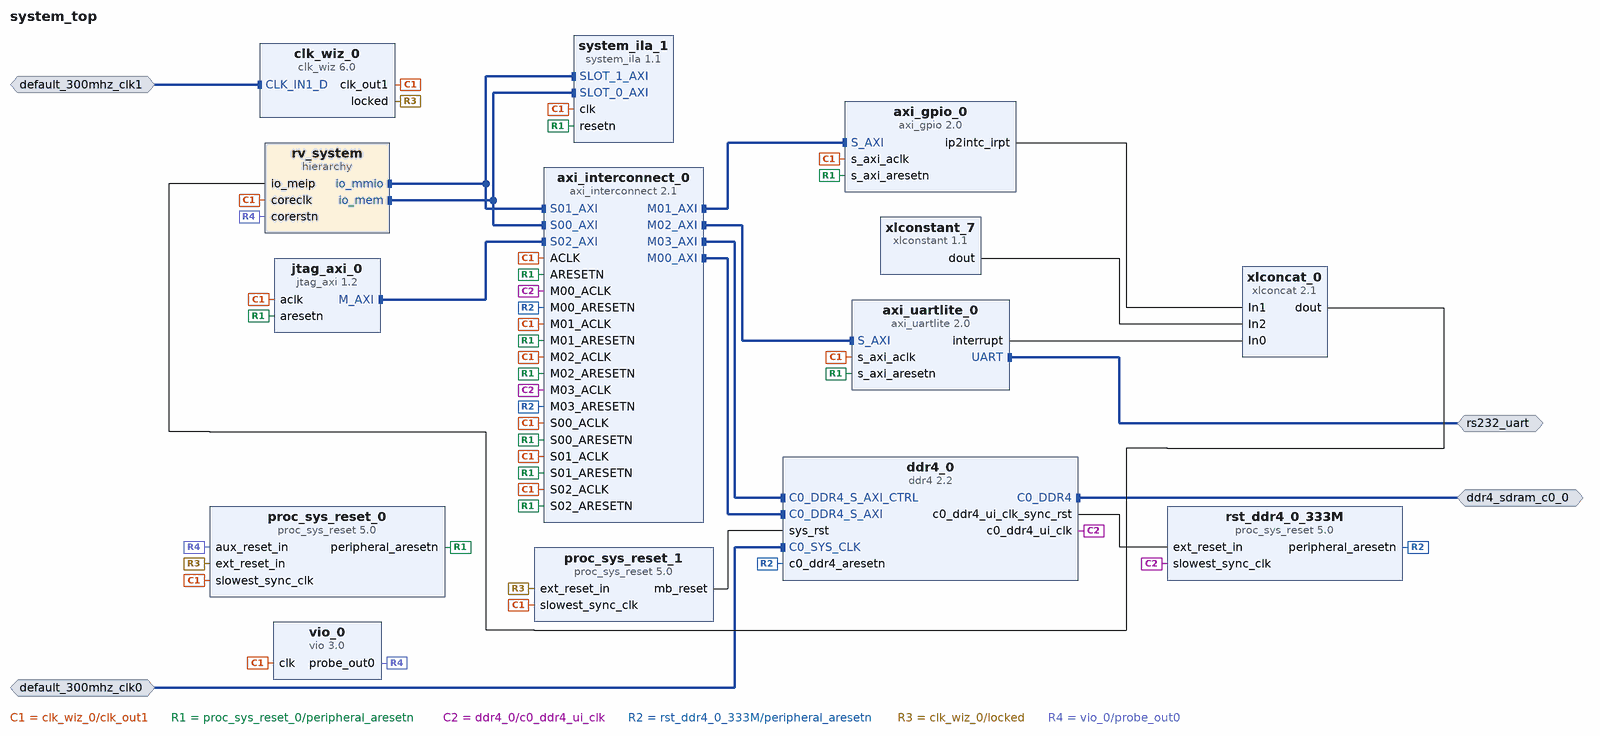
[diagram p0: block diagram of the top level]
# Vivado block design system_top, xcu250-figd2104-2L-e, Vivado 2020.2
create_bd_design system_top

create_bd_intf_port -mode Master -vlnv xilinx.com:interface:uart_rtl:1.0 rs232_uart
create_bd_intf_port -mode Slave -vlnv xilinx.com:interface:diff_clock_rtl:1.0 default_300mhz_clk0
set_property -dict {CONFIG.FREQ_HZ 300000000} [get_bd_intf_ports default_300mhz_clk0]
create_bd_intf_port -mode Master -vlnv xilinx.com:interface:ddr4_rtl:1.0 ddr4_sdram_c0_0
create_bd_intf_port -mode Slave -vlnv xilinx.com:interface:diff_clock_rtl:1.0 default_300mhz_clk1
set_property -dict {CONFIG.FREQ_HZ 300000000} [get_bd_intf_ports default_300mhz_clk1]

create_bd_cell -type hier rv_system
create_bd_cell -type ip -vlnv xilinx.com:ip:clk_wiz:6.0 clk_wiz_0
set_property -dict [list \
  CONFIG.CLK_IN1_BOARD_INTERFACE default_300mhz_clk1 \
  CONFIG.PRIM_SOURCE Differential_clock_capable_pin \
  CONFIG.RESET_BOARD_INTERFACE Custom \
  CONFIG.USE_BOARD_FLOW true \
  CONFIG.USE_RESET false \
] [get_bd_cells clk_wiz_0]
create_bd_cell -type ip -vlnv xilinx.com:ip:proc_sys_reset:5.0 proc_sys_reset_0
create_bd_cell -type ip -vlnv xilinx.com:ip:ddr4:2.2 ddr4_0
set_property -dict [list \
  CONFIG.C0_CLOCK_BOARD_INTERFACE default_300mhz_clk0 \
  CONFIG.C0_DDR4_BOARD_INTERFACE ddr4_sdram_c0 \
] [get_bd_cells ddr4_0]
create_bd_cell -type ip -vlnv xilinx.com:ip:axi_gpio:2.0 axi_gpio_0
set_property -dict [list \
  CONFIG.C_ALL_INPUTS 0 \
  CONFIG.C_ALL_OUTPUTS 1 \
  CONFIG.C_GPIO_WIDTH 1 \
  CONFIG.C_INTERRUPT_PRESENT 1 \
] [get_bd_cells axi_gpio_0]
create_bd_cell -type ip -vlnv xilinx.com:ip:axi_uartlite:2.0 axi_uartlite_0
set_property -dict [list \
  CONFIG.C_BAUDRATE 115200 \
  CONFIG.UARTLITE_BOARD_INTERFACE rs232_uart \
  CONFIG.USE_BOARD_FLOW true \
] [get_bd_cells axi_uartlite_0]
create_bd_cell -type ip -vlnv xilinx.com:ip:axi_interconnect:2.1 axi_interconnect_0
set_property -dict {CONFIG.NUM_MI 4 CONFIG.NUM_SI 3} [get_bd_cells axi_interconnect_0]
create_bd_cell -type ip -vlnv xilinx.com:ip:proc_sys_reset:5.0 rst_ddr4_0_333M
create_bd_cell -type ip -vlnv xilinx.com:ip:jtag_axi:1.2 jtag_axi_0
create_bd_cell -type ip -vlnv xilinx.com:ip:xlconcat:2.1 xlconcat_0
set_property -dict {CONFIG.NUM_PORTS 3 CONFIG.dout_width 3} [get_bd_cells xlconcat_0]
create_bd_cell -type ip -vlnv xilinx.com:ip:vio:3.0 vio_0
set_property -dict {CONFIG.C_NUM_PROBE_IN 0} [get_bd_cells vio_0]
create_bd_cell -type ip -vlnv xilinx.com:ip:proc_sys_reset:5.0 proc_sys_reset_1
create_bd_cell -type ip -vlnv xilinx.com:ip:xlconstant:1.1 xlconstant_7
create_bd_cell -type ip -vlnv xilinx.com:ip:system_ila:1.1 system_ila_1
set_property -dict [list \
  CONFIG.C_MON_TYPE INTERFACE \
  CONFIG.C_NUM_MONITOR_SLOTS 2 \
  CONFIG.C_NUM_OF_PROBES 9 \
  CONFIG.C_PROBE0_WIDTH 1 \
  CONFIG.C_PROBE5_WIDTH 1 \
  CONFIG.C_PROBE6_WIDTH 1 \
  CONFIG.C_PROBE7_WIDTH 1 \
  CONFIG.C_PROBE_WIDTH_PROPAGATION MANUAL \
] [get_bd_cells system_ila_1]

# ---- hierarchy /rv_system ----
current_bd_instance /rv_system
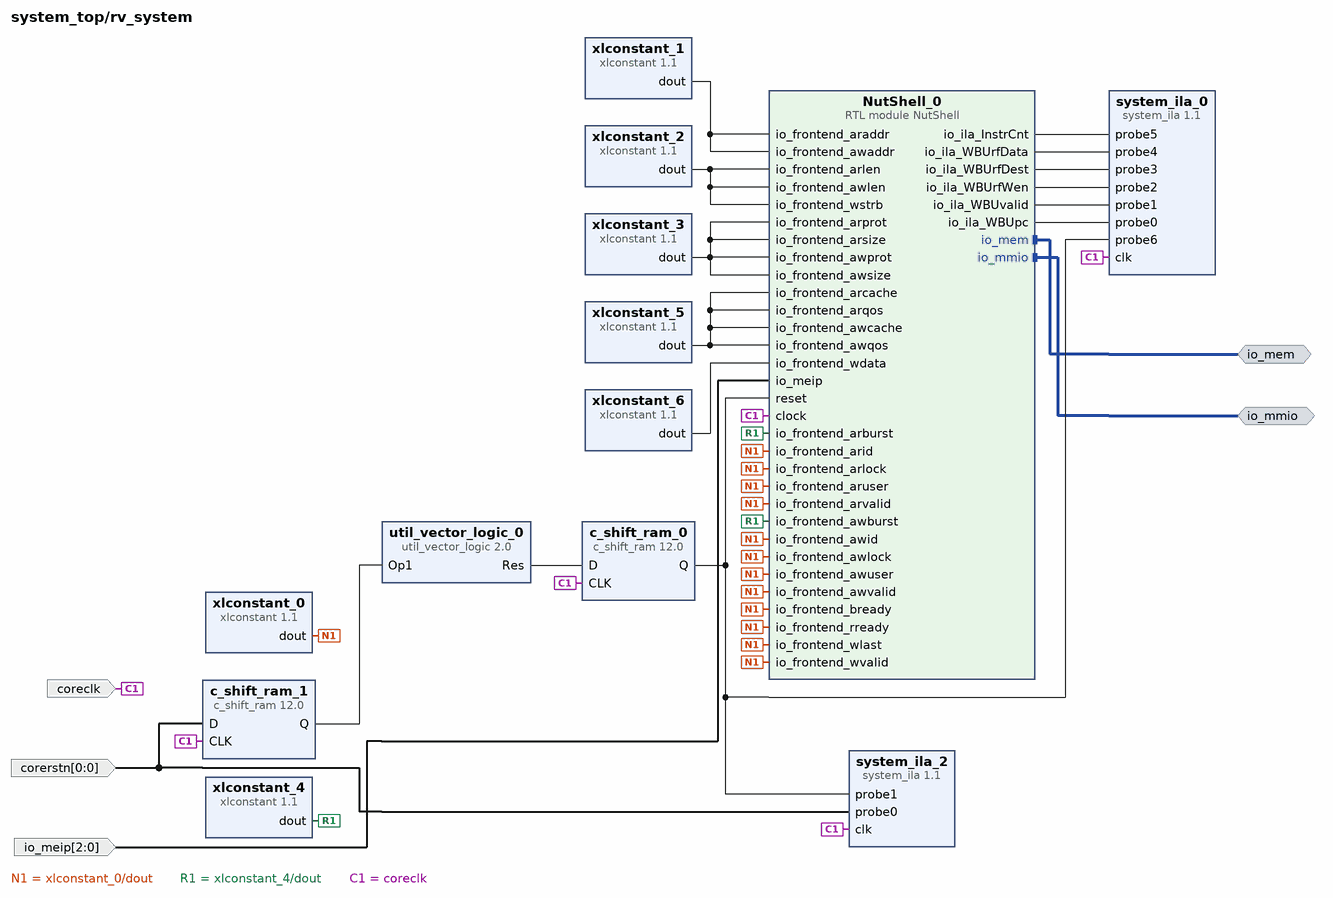
[diagram p1: block diagram inside /rv_system]
create_bd_intf_pin -mode Master -vlnv xilinx.com:interface:aximm_rtl:1.0 io_mem
create_bd_intf_pin -mode Master -vlnv xilinx.com:interface:aximm_rtl:1.0 io_mmio
create_bd_pin -dir I -type clk coreclk
create_bd_pin -dir I -from 0 -to 0 -type data corerstn
create_bd_pin -dir I -from 2 -to 0 io_meip

create_bd_cell -type ip -vlnv xilinx.com:ip:c_shift_ram:12.0 c_shift_ram_0
set_property -dict {CONFIG.AsyncInitVal 0 CONFIG.DefaultData 0 CONFIG.Depth 1 CONFIG.Width 1} [get_bd_cells c_shift_ram_0]
create_bd_cell -type ip -vlnv xilinx.com:ip:xlconstant:1.1 xlconstant_0
set_property -dict {CONFIG.CONST_VAL 0} [get_bd_cells xlconstant_0]
create_bd_cell -type ip -vlnv xilinx.com:ip:xlconstant:1.1 xlconstant_1
set_property -dict {CONFIG.CONST_VAL 0 CONFIG.CONST_WIDTH 32} [get_bd_cells xlconstant_1]
create_bd_cell -type ip -vlnv xilinx.com:ip:xlconstant:1.1 xlconstant_2
set_property -dict {CONFIG.CONST_VAL 0 CONFIG.CONST_WIDTH 8} [get_bd_cells xlconstant_2]
create_bd_cell -type ip -vlnv xilinx.com:ip:xlconstant:1.1 xlconstant_3
set_property -dict {CONFIG.CONST_VAL 0 CONFIG.CONST_WIDTH 3} [get_bd_cells xlconstant_3]
create_bd_cell -type ip -vlnv xilinx.com:ip:xlconstant:1.1 xlconstant_4
set_property -dict {CONFIG.CONST_VAL 0 CONFIG.CONST_WIDTH 2} [get_bd_cells xlconstant_4]
create_bd_cell -type ip -vlnv xilinx.com:ip:xlconstant:1.1 xlconstant_5
set_property -dict {CONFIG.CONST_VAL 0 CONFIG.CONST_WIDTH 4} [get_bd_cells xlconstant_5]
create_bd_cell -type ip -vlnv xilinx.com:ip:xlconstant:1.1 xlconstant_6
set_property -dict {CONFIG.CONST_VAL 0 CONFIG.CONST_WIDTH 64} [get_bd_cells xlconstant_6]
create_bd_cell -type ip -vlnv xilinx.com:ip:c_shift_ram:12.0 c_shift_ram_1
set_property -dict {CONFIG.AsyncInitVal 0 CONFIG.DefaultData 0 CONFIG.Depth 1 CONFIG.Width 1} [get_bd_cells c_shift_ram_1]
create_bd_cell -type ip -vlnv xilinx.com:ip:system_ila:1.1 system_ila_0
set_property -dict {CONFIG.C_MON_TYPE NATIVE CONFIG.C_NUM_MONITOR_SLOTS 1 CONFIG.C_NUM_OF_PROBES 7} [get_bd_cells system_ila_0]
create_bd_cell -type ip -vlnv xilinx.com:ip:system_ila:1.1 system_ila_2
set_property -dict {CONFIG.C_MON_TYPE NATIVE CONFIG.C_NUM_OF_PROBES 2} [get_bd_cells system_ila_2]
create_bd_cell -type module -reference NutShell NutShell_0
create_bd_cell -type ip -vlnv xilinx.com:ip:util_vector_logic:2.0 util_vector_logic_0
set_property -dict {CONFIG.C_OPERATION not CONFIG.C_SIZE 1} [get_bd_cells util_vector_logic_0]

# ---- connections ----

current_bd_instance /rv_system
connect_bd_intf_net [get_bd_intf_pins io_mem] [get_bd_intf_pins NutShell_0/io_mem]
connect_bd_intf_net [get_bd_intf_pins io_mmio] [get_bd_intf_pins NutShell_0/io_mmio]
connect_bd_net [get_bd_pins xlconstant_0/dout] \
  [get_bd_pins NutShell_0/io_frontend_awvalid] [get_bd_pins NutShell_0/io_frontend_awid] \
  [get_bd_pins NutShell_0/io_frontend_awuser] [get_bd_pins NutShell_0/io_frontend_awlock] \
  [get_bd_pins NutShell_0/io_frontend_wvalid] [get_bd_pins NutShell_0/io_frontend_wlast] \
  [get_bd_pins NutShell_0/io_frontend_bready] [get_bd_pins NutShell_0/io_frontend_arvalid] \
  [get_bd_pins NutShell_0/io_frontend_arid] [get_bd_pins NutShell_0/io_frontend_aruser] \
  [get_bd_pins NutShell_0/io_frontend_arlock] [get_bd_pins NutShell_0/io_frontend_rready]
connect_bd_net [get_bd_pins xlconstant_1/dout] [get_bd_pins NutShell_0/io_frontend_awaddr] [get_bd_pins NutShell_0/io_frontend_araddr]
connect_bd_net [get_bd_pins xlconstant_2/dout] \
  [get_bd_pins NutShell_0/io_frontend_awlen] [get_bd_pins NutShell_0/io_frontend_wstrb] \
  [get_bd_pins NutShell_0/io_frontend_arlen]
connect_bd_net [get_bd_pins xlconstant_3/dout] \
  [get_bd_pins NutShell_0/io_frontend_awprot] [get_bd_pins NutShell_0/io_frontend_awsize] \
  [get_bd_pins NutShell_0/io_frontend_arprot] [get_bd_pins NutShell_0/io_frontend_arsize]
connect_bd_net [get_bd_pins xlconstant_4/dout] [get_bd_pins NutShell_0/io_frontend_awburst] [get_bd_pins NutShell_0/io_frontend_arburst]
connect_bd_net [get_bd_pins xlconstant_5/dout] \
  [get_bd_pins NutShell_0/io_frontend_awcache] [get_bd_pins NutShell_0/io_frontend_awqos] \
  [get_bd_pins NutShell_0/io_frontend_arcache] [get_bd_pins NutShell_0/io_frontend_arqos]
connect_bd_net [get_bd_pins xlconstant_6/dout] [get_bd_pins NutShell_0/io_frontend_wdata]
connect_bd_net [get_bd_pins c_shift_ram_0/Q] [get_bd_pins system_ila_2/probe1] [get_bd_pins system_ila_0/probe6] [get_bd_pins NutShell_0/reset]
connect_bd_net [get_bd_pins corerstn] [get_bd_pins c_shift_ram_1/D] [get_bd_pins system_ila_2/probe0]
connect_bd_net [get_bd_pins io_meip] [get_bd_pins NutShell_0/io_meip]
connect_bd_net [get_bd_pins NutShell_0/io_ila_InstrCnt] [get_bd_pins system_ila_0/probe5]
connect_bd_net [get_bd_pins NutShell_0/io_ila_WBUrfData] [get_bd_pins system_ila_0/probe4]
connect_bd_net [get_bd_pins NutShell_0/io_ila_WBUrfDest] [get_bd_pins system_ila_0/probe3]
connect_bd_net [get_bd_pins NutShell_0/io_ila_WBUrfWen] [get_bd_pins system_ila_0/probe2]
connect_bd_net [get_bd_pins NutShell_0/io_ila_WBUvalid] [get_bd_pins system_ila_0/probe1]
connect_bd_net [get_bd_pins NutShell_0/io_ila_WBUpc] [get_bd_pins system_ila_0/probe0]
connect_bd_net [get_bd_pins coreclk] \
  [get_bd_pins c_shift_ram_1/CLK] [get_bd_pins c_shift_ram_0/CLK] [get_bd_pins system_ila_0/clk] \
  [get_bd_pins system_ila_2/clk] [get_bd_pins NutShell_0/clock]
connect_bd_net [get_bd_pins c_shift_ram_1/Q] [get_bd_pins util_vector_logic_0/Op1]
connect_bd_net [get_bd_pins util_vector_logic_0/Res] [get_bd_pins c_shift_ram_0/D]

current_bd_instance /
connect_bd_intf_net [get_bd_intf_pins axi_interconnect_0/M03_AXI] [get_bd_intf_pins ddr4_0/C0_DDR4_S_AXI_CTRL]
connect_bd_intf_net [get_bd_intf_pins axi_interconnect_0/M01_AXI] [get_bd_intf_pins axi_gpio_0/S_AXI]
connect_bd_intf_net [get_bd_intf_pins rv_system/io_mmio] [get_bd_intf_pins axi_interconnect_0/S01_AXI]
connect_bd_intf_net [get_bd_intf_pins rv_system/io_mmio] [get_bd_intf_pins system_ila_1/SLOT_1_AXI]
connect_bd_intf_net -intf_net default_300mhz_clk1_1 [get_bd_intf_ports default_300mhz_clk1] [get_bd_intf_pins clk_wiz_0/CLK_IN1_D]
connect_bd_intf_net [get_bd_intf_pins axi_interconnect_0/M00_AXI] [get_bd_intf_pins ddr4_0/C0_DDR4_S_AXI]
connect_bd_intf_net [get_bd_intf_pins rv_system/io_mem] [get_bd_intf_pins axi_interconnect_0/S00_AXI]
connect_bd_intf_net [get_bd_intf_pins rv_system/io_mem] [get_bd_intf_pins system_ila_1/SLOT_0_AXI]
connect_bd_intf_net [get_bd_intf_pins axi_interconnect_0/M02_AXI] [get_bd_intf_pins axi_uartlite_0/S_AXI]
connect_bd_intf_net -intf_net default_300mhz_clk0_1 [get_bd_intf_ports default_300mhz_clk0] [get_bd_intf_pins ddr4_0/C0_SYS_CLK]
connect_bd_intf_net [get_bd_intf_ports rs232_uart] [get_bd_intf_pins axi_uartlite_0/UART]
connect_bd_intf_net [get_bd_intf_ports ddr4_sdram_c0_0] [get_bd_intf_pins ddr4_0/C0_DDR4]
connect_bd_intf_net [get_bd_intf_pins jtag_axi_0/M_AXI] [get_bd_intf_pins axi_interconnect_0/S02_AXI]
connect_bd_net [get_bd_pins clk_wiz_0/clk_out1] \
  [get_bd_pins proc_sys_reset_0/slowest_sync_clk] [get_bd_pins rv_system/coreclk] [get_bd_pins axi_interconnect_0/S00_ACLK] \
  [get_bd_pins axi_gpio_0/s_axi_aclk] [get_bd_pins axi_interconnect_0/M01_ACLK] [get_bd_pins axi_interconnect_0/ACLK] \
  [get_bd_pins axi_uartlite_0/s_axi_aclk] [get_bd_pins axi_interconnect_0/M02_ACLK] [get_bd_pins axi_interconnect_0/S01_ACLK] \
  [get_bd_pins jtag_axi_0/aclk] [get_bd_pins axi_interconnect_0/S02_ACLK] [get_bd_pins vio_0/clk] \
  [get_bd_pins proc_sys_reset_1/slowest_sync_clk] [get_bd_pins system_ila_1/clk]
connect_bd_net [get_bd_pins proc_sys_reset_0/peripheral_aresetn] \
  [get_bd_pins axi_interconnect_0/S00_ARESETN] [get_bd_pins axi_gpio_0/s_axi_aresetn] \
  [get_bd_pins axi_interconnect_0/M01_ARESETN] [get_bd_pins axi_interconnect_0/ARESETN] \
  [get_bd_pins axi_uartlite_0/s_axi_aresetn] [get_bd_pins axi_interconnect_0/M02_ARESETN] \
  [get_bd_pins axi_interconnect_0/S01_ARESETN] [get_bd_pins jtag_axi_0/aresetn] [get_bd_pins axi_interconnect_0/S02_ARESETN] \
  [get_bd_pins system_ila_1/resetn]
connect_bd_net [get_bd_pins ddr4_0/c0_ddr4_ui_clk] \
  [get_bd_pins axi_interconnect_0/M00_ACLK] [get_bd_pins rst_ddr4_0_333M/slowest_sync_clk] \
  [get_bd_pins axi_interconnect_0/M03_ACLK]
connect_bd_net [get_bd_pins rst_ddr4_0_333M/peripheral_aresetn] \
  [get_bd_pins axi_interconnect_0/M00_ARESETN] [get_bd_pins ddr4_0/c0_ddr4_aresetn] \
  [get_bd_pins axi_interconnect_0/M03_ARESETN]
connect_bd_net [get_bd_pins axi_uartlite_0/interrupt] [get_bd_pins xlconcat_0/In0]
connect_bd_net [get_bd_pins axi_gpio_0/ip2intc_irpt] [get_bd_pins xlconcat_0/In1]
connect_bd_net [get_bd_pins ddr4_0/c0_ddr4_ui_clk_sync_rst] [get_bd_pins rst_ddr4_0_333M/ext_reset_in]
connect_bd_net [get_bd_pins xlconcat_0/dout] [get_bd_pins rv_system/io_meip]
connect_bd_net [get_bd_pins clk_wiz_0/locked] [get_bd_pins proc_sys_reset_0/ext_reset_in] [get_bd_pins proc_sys_reset_1/ext_reset_in]
connect_bd_net [get_bd_pins proc_sys_reset_1/mb_reset] [get_bd_pins ddr4_0/sys_rst]
connect_bd_net [get_bd_pins xlconstant_7/dout] [get_bd_pins xlconcat_0/In2]
connect_bd_net [get_bd_pins vio_0/probe_out0] [get_bd_pins proc_sys_reset_0/aux_reset_in] [get_bd_pins rv_system/corerstn]

# ---- address map ----
assign_bd_address -offset 0x40000000 -range 64K -target_address_space [get_bd_addr_spaces jtag_axi_0/Data] [get_bd_addr_segs axi_gpio_0/S_AXI/Reg]
assign_bd_address -offset 0x40600000 -range 64K -target_address_space [get_bd_addr_spaces jtag_axi_0/Data] [get_bd_addr_segs axi_uartlite_0/S_AXI/Reg]
assign_bd_address -offset 0x40700000 -range 1M -target_address_space [get_bd_addr_spaces jtag_axi_0/Data] [get_bd_addr_segs ddr4_0/C0_DDR4_MEMORY_MAP_CTRL/C0_REG]
assign_bd_address -offset 0x80000000 -range 2G -target_address_space [get_bd_addr_spaces jtag_axi_0/Data] [get_bd_addr_segs ddr4_0/C0_DDR4_MEMORY_MAP/C0_DDR4_ADDRESS_BLOCK]
assign_bd_address -offset 0x40000000 -range 64K -target_address_space [get_bd_addr_spaces rv_system/NutShell_0/io_mem] [get_bd_addr_segs axi_gpio_0/S_AXI/Reg]
assign_bd_address -offset 0x40600000 -range 64K -target_address_space [get_bd_addr_spaces rv_system/NutShell_0/io_mem] [get_bd_addr_segs axi_uartlite_0/S_AXI/Reg]
assign_bd_address -offset 0x40700000 -range 1M -target_address_space [get_bd_addr_spaces rv_system/NutShell_0/io_mem] [get_bd_addr_segs ddr4_0/C0_DDR4_MEMORY_MAP_CTRL/C0_REG]
assign_bd_address -offset 0x80000000 -range 2G -target_address_space [get_bd_addr_spaces rv_system/NutShell_0/io_mem] [get_bd_addr_segs ddr4_0/C0_DDR4_MEMORY_MAP/C0_DDR4_ADDRESS_BLOCK]
assign_bd_address -offset 0x40000000 -range 64K -target_address_space [get_bd_addr_spaces rv_system/NutShell_0/io_mmio] [get_bd_addr_segs axi_gpio_0/S_AXI/Reg]
assign_bd_address -offset 0x40600000 -range 64K -target_address_space [get_bd_addr_spaces rv_system/NutShell_0/io_mmio] [get_bd_addr_segs axi_uartlite_0/S_AXI/Reg]
assign_bd_address -offset 0x40700000 -range 1M -target_address_space [get_bd_addr_spaces rv_system/NutShell_0/io_mmio] [get_bd_addr_segs ddr4_0/C0_DDR4_MEMORY_MAP_CTRL/C0_REG]
assign_bd_address -offset 0x80000000 -range 2G -target_address_space [get_bd_addr_spaces rv_system/NutShell_0/io_mmio] [get_bd_addr_segs ddr4_0/C0_DDR4_MEMORY_MAP/C0_DDR4_ADDRESS_BLOCK]

validate_bd_design
save_bd_design
